# EAGLE schematic power_PCB_schematic (EAGLE 7.7.0)
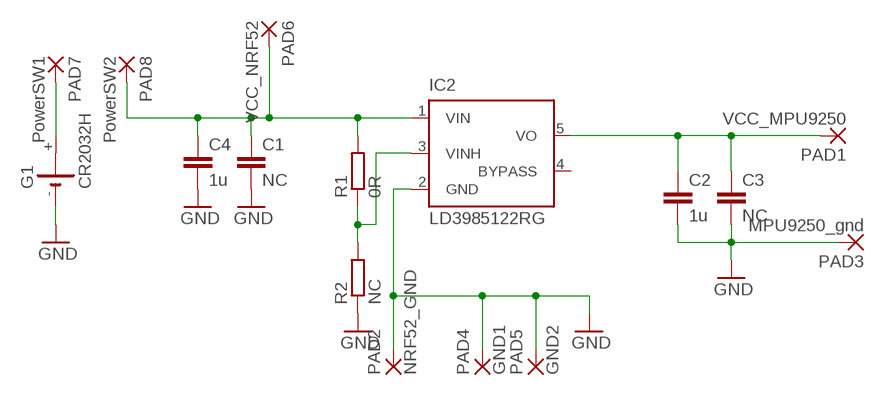
[diagram p0: schematic, sheet 1]

## Parts
C1  NC  C-EUC0805  [C0805]
C2  1u  C-EUC0805  [C0805]
C3  NC  C-EUC0805  [C0805]
C4  1u  C-EUC0805  [C0805]
G1  CR2032H  [CR2032H]
IC2  LD3985122RG  [TSOT23-5L]
PAD1  VCC_MPU9250  2,54/1,0  [2,54/1,0]
PAD2  NRF52_GND  2,54/1,0  [2,54/1,0]
PAD3  MPU9250_gnd  2,54/1,0  [2,54/1,0]
PAD4  GND1  2,54/1,0  [2,54/1,0]
PAD5  GND2  2,54/1,0  [2,54/1,0]
PAD6  VCC_NRF52  2,54/1,0  [2,54/1,0]
PAD7  PowerSW1  2,54/1,0  [2,54/1,0]
PAD8  PowerSW2  2,54/1,0  [2,54/1,0]
R1  0R  R-EU_R1206  [R1206]
R2  NC  R-EU_R0603  [R0603]

## Nets
GND: C1.2 C2.2 C3.2 C4.2 G1.- IC2.2(GND) PAD2.1(P) PAD3.1(P) PAD4.1(P) PAD5.1(P) R2.1
N$2: C2.1 C3.1 IC2.5(VO) PAD1.1(P)
N$3: G1.+ PAD7.1(P)
N$4: C1.1 C4.1 IC2.1(VIN) PAD6.1(P) PAD8.1(P) R1.2
N$5: IC2.3(VINH) R1.1 R2.2
Unconnected: G1.+@1(+) IC2.4(BYPASS)

## Library data of the parts
C1-C4 = resistor:C-EU: CAPACITOR, European symbol
G1 = battery:CR2032H: LI BATTERY Varta
IC2 = st-microelectronics:LD3985: Ultra low drop and low noise BiCMOS voltage regulators Source: www.st.com LD3985.pdf
PAD1-PAD8 = wirepad:2,54/1,0: THROUGH-HOLE PAD
R1 R2 = resistor:R-EU_: RESISTOR, European symbol